# Altium schematic sheet clock_generator.SchDoc: Fine Delay FMC
size 297 x 209 mm; CheckedBy: B. Civel; Author: TW; CompanyName: CERN; DrawnBy: TW, GK; Engineer: TW; Organization: CERN; Address1: European Organization for Nuclear Research; Address2: CH-1211 Geneve 23 - Switzerland; DocumentNumber: 2; Revision: -; SheetNumber: 2; SheetTotal: 10; ModifiedBy: B. Civel; CreateDate: 16/08/2012; CheckedDate: 06/06/2013; Title2: PLL & clock distribution; EDA_Number: EDA-02267-V6-1; Projet: Fine Delay FMC (FMCDel1ns4cha); DivGrp: BE-CO; Designer: TW, GK; ModifiedDate: 16/08/2012
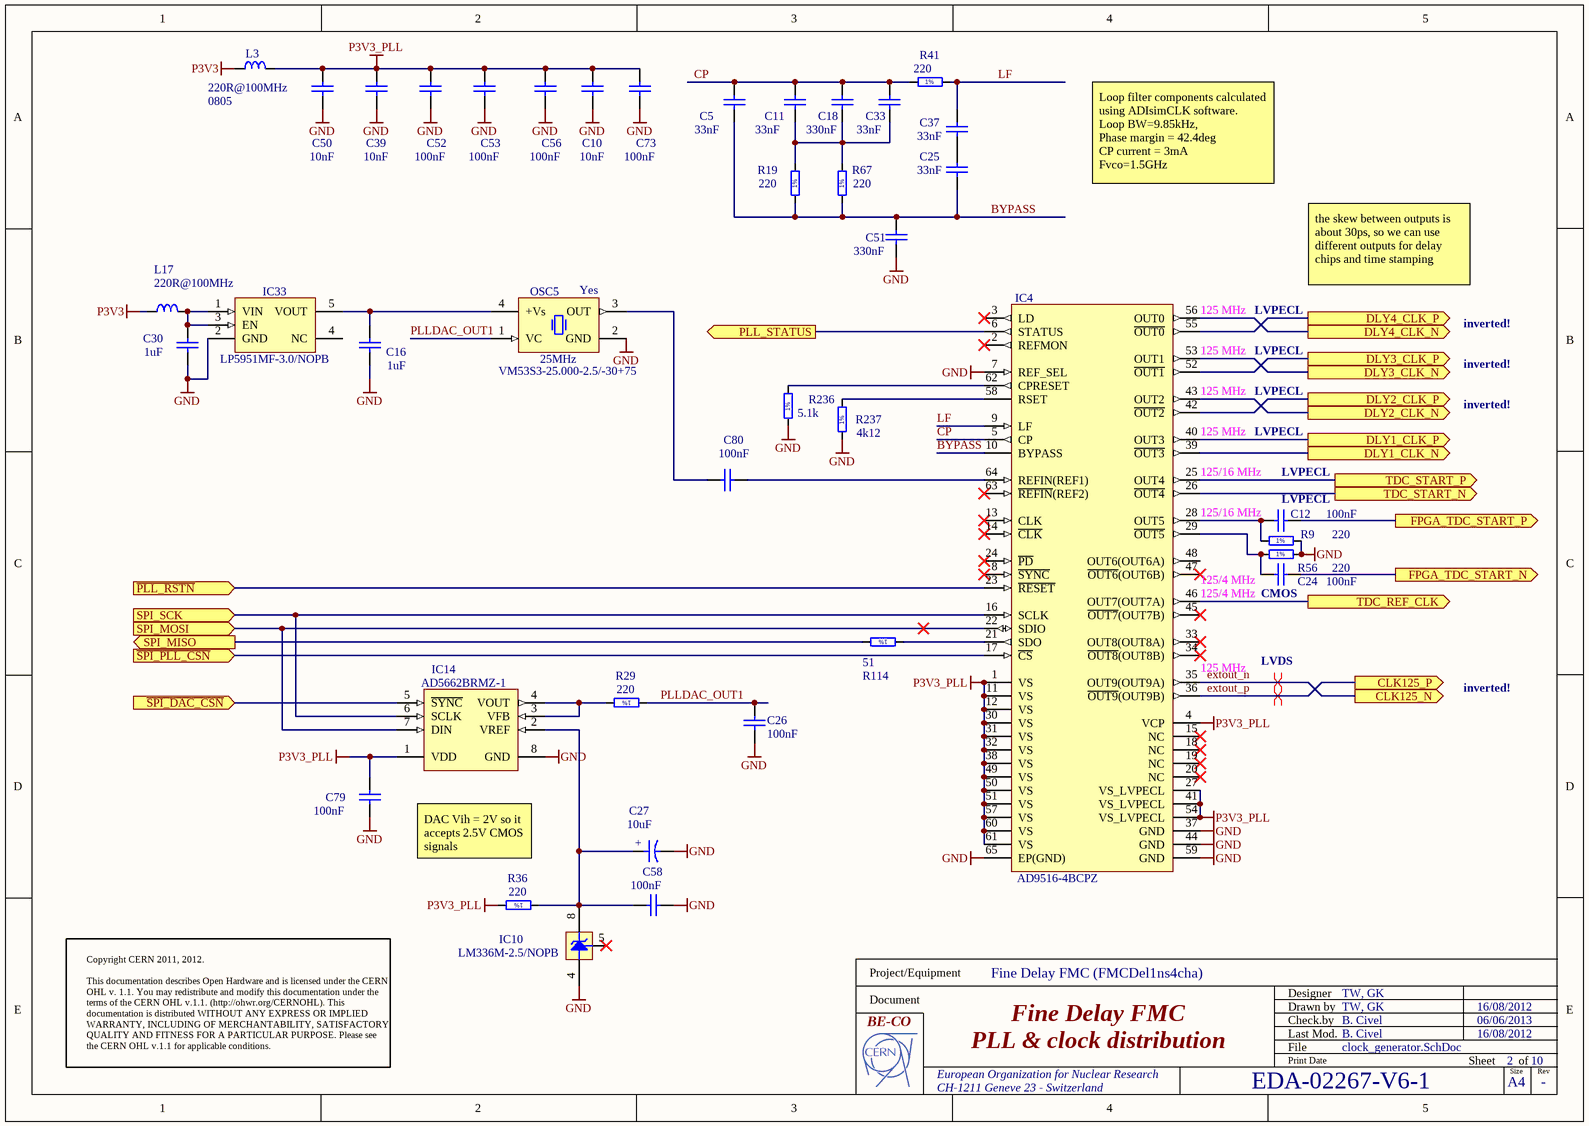
[diagram p0: clock_generator.SchDoc]

## Parts
C5  33nF  [CAPC1608X87N]
C10  10nF  [CAPC1608X87N]
C11  33nF  [CAPC1608X87N]
C12  100nF  [CAPC1608X87N]
C16  1uF  [CAPC2012X140N]
C18  330nF  [CAPC1608X87N]
C24  100nF  [CAPC1608X87N]
C25  33nF  [CAPC1608X87N]
C26  100nF  [CAPC1608X87N]
C27  10uF  [CAPMP3528X210N]
C30  1uF  [CAPC2012X140N]
C33  33nF  [CAPC1608X87N]
C37  33nF  [CAPC1608X87N]
C39  10nF  [CAPC1608X87N]
C50  10nF  [CAPC1608X87N]
C51  330nF  [CAPC1608X87N]
C52  100nF  [CAPC1608X87N]
C53  100nF  [CAPC1608X87N]
C56  100nF  [CAPC1608X87N]
C58  100nF  [CAPC1608X87N]
C73  100nF  [CAPC1608X87N]
C79  100nF  [CAPC1608X87N]
C80  100nF  [CAPC1608X87N]
IC4  AD9516-4BCPZ  [QFN50P900X900X100-65N-S635]
IC10  LM336M-2.5/NOPB  [SOIC127P600X175-8N]
IC14  AD5662BRMZ-1  [SOP65P490X110-8N]
IC33  LP5951MF-3.0/NOPB  [SOT95P284X122-5N]
L3  220R@100MHz  Case: 0805  [INDC2012X105N]
L17  220R@100MHz  [INDC2012X105N]
OSC5  25MHz  Manufacturer Part Number: VM53S3-25.000-2.5/-30+75  Mounted: Yes  [OSCCC320X500X160-4N]
R9  220  [RESC1608X55N]
R19  220  [RESC1608X55N]
R29  220  [RESC1608X55N]
R36  220  [RESC1608X55N]
R41  220  [RESC1608X55N]
R56  220  [RESC1608X55N]
R67  220  [RESC1608X55N]
R114  51  [RESC1608X55N]
R236  5.1k  [RESC1608X55N]
R237  4k12  [RESC1608X55N]

## Ports
CLK125_N (out), CLK125_P (out), DLY1_CLK_N (out), DLY1_CLK_P (out), DLY2_CLK_N (out), DLY2_CLK_P (out), DLY3_CLK_N (out), DLY3_CLK_P (out), DLY4_CLK_N (out), DLY4_CLK_P (out), FPGA_TDC_START_N (out), FPGA_TDC_START_P (out), PLL_STATUS (out), SPI_MISO (out), SPI_MOSI (in), SPI_SCK (in), TDC_REF_CLK (out), TDC_START_N (out), TDC_START_P (out), ~{PLL_RSTN} (in), ~{SPI_DAC_CSN} (in), ~{SPI_PLL_CSN} (in)

## Nets
GND: C10.2 C16.2 C26.2 C27.2 C30.2 C39.2 C50.2 C51.1 C52.1 C53.1 C56.1 C58.1 C73.1 C79.1 IC4.7(REF_SEL) IC4.37(GND) IC4.44(GND) IC4.59(GND) IC4.65(EP(GND)) IC10.4(A) IC14.8(GND) IC33.2(GND) OSC5.2(GND) R9.2 R56.2 R236.1 R237.1
P3V3: L3.1 L17.1
P3V3_PLL: C10.1 C39.1 C50.1 C52.2 C53.2 C56.2 C73.2 C79.2 IC4.1(VS) IC4.4(VCP) IC4.11(VS) IC4.12(VS) IC4.27(VS_LVPECL) IC4.30(VS) IC4.31(VS) IC4.32(VS) IC4.38(VS) IC4.41(VS_LVPECL) IC4.49(VS) IC4.50(VS) IC4.51(VS) IC4.54(VS_LVPECL) IC4.57(VS) IC4.60(VS) IC4.61(VS) IC14.1(VDD) L3.2 R36.2
~{PLL_RSTN}: IC4.23(~{RESET}) ; port ~{PLL_RSTN}
~{SPI_DAC_CSN}: IC14.5(~{SYNC}) ; port ~{SPI_DAC_CSN}
~{SPI_PLL_CSN}: IC4.17(~{CS}) ; port ~{SPI_PLL_CSN}
BYPASS: C5.1 C25.1 C51.2 IC4.10(BYPASS) R19.1 R67.1
CP: C5.2 C11.2 C18.2 C33.2 IC4.5(CP) R41.1
DLY1_CLK_N: IC4.39(~{OUT3}) ; port DLY1_CLK_N
DLY1_CLK_P: IC4.40(OUT3) ; port DLY1_CLK_P
DLY2_CLK_N: IC4.43(OUT2) ; port DLY2_CLK_N
DLY2_CLK_P: IC4.42(~{OUT2}) ; port DLY2_CLK_P
DLY3_CLK_N: IC4.53(OUT1) ; port DLY3_CLK_N
DLY3_CLK_P: IC4.52(~{OUT1}) ; port DLY3_CLK_P
DLY4_CLK_N: IC4.56(OUT0) ; port DLY4_CLK_N
DLY4_CLK_P: IC4.55(~{OUT0}) ; port DLY4_CLK_P
extout_n: IC4.35(OUT9(OUT9A)) ; port CLK125_N
extout_p: IC4.36(~{OUT9}(OUT9B)) ; port CLK125_P
FPGA_TDC_START_N: C24.1 ; port FPGA_TDC_START_N
FPGA_TDC_START_P: C12.1 ; port FPGA_TDC_START_P
LF: C37.2 IC4.9(LF) R41.2
PLL_STATUS: IC4.6(STATUS) ; port PLL_STATUS
PLLDAC_OUT1: C26.1 OSC5.1(VC) R29.1
SPI_MISO: R114.2 ; port SPI_MISO
SPI_MOSI: IC4.22(SDIO) IC14.7(DIN) ; port SPI_MOSI
SPI_SCK: IC4.16(SCLK) IC14.6(SCLK) ; port SPI_SCK
TDC_REF_CLK: IC4.46(OUT7(OUT7A)) ; port TDC_REF_CLK
TDC_START_N: IC4.26(~{OUT4}) ; port TDC_START_N
TDC_START_P: IC4.25(OUT4) ; port TDC_START_P
NetC11_1: C11.1 C18.1 C33.1 R19.2 R67.2
NetC12_2: C12.2 IC4.28(OUT5) R9.1
NetC16_1: C16.1 IC33.5(VOUT) OSC5.4(+Vs)
NetC24_2: C24.2 IC4.29(~{OUT5}) R56.1
NetC25_2: C25.2 C37.1
NetC27_1: C27.1 C58.2 IC10.8(C) IC14.2(VREF) R36.1
NetC30_1: C30.1 IC33.1(VIN) IC33.3(EN) L17.2
NetC80_1: C80.1 IC4.64(REFIN(REF1))
NetC80_2: C80.2 OSC5.3(OUT)
NetIC4_21: IC4.21(SDO) R114.1
NetIC4_58: IC4.58(RSET) R237.2
NetIC4_62: IC4.62(CPRESET) R236.2
NetIC14_3: IC14.3(VFB) IC14.4(VOUT) R29.2

Not connected (* = marked no-connect by the designer): IC4 2(REFMON)* 3(LD)* 8(~{SYNC})* 13(CLK)* 14(~{CLK})* 15(NC)* 18(NC)* 19(NC)* 20(NC)* 24(~{PD})* 33(OUT8(OUT8A))* 34(~{OUT8}(OUT8B))* 45(~{OUT7}(OUT7B))* 47(~{OUT6}(OUT6B))* 48(OUT6(OUT6A)) 63(~{REFIN}(REF2))*; IC10 5(Adj)*; IC33 4(NC)

## Layout directives
differential pair: extout_n, extout_p

## Notes on the sheet
- Loop filter components calculated using ADIsimCLK software.
  Loop BW=9.85kHz,
  Phase margin = 42.4deg
  CP current = 3mA
  Fvco=1.5GHz
- (near IC4) 125 MHz
- LVPECL
- the skew between outputs is about 30ps, so we can use different outputs for delay chips and time stamping
- inverted!
- 125/16 MHz
- (near C12) LVPECL
- 125/4 MHz
- (near C24) CMOS
- LVDS
- DAC Vih = 2V so it accepts 2.5V CMOS signals
- Copyright CERN 2011, 2012.
  This documentation describes Open Hardware and is licensed under the CERN OHL v. 1.1. You may redistribute and modify this documentation under the terms of the CERN OHL v.1.1. (http://ohwr.org/CERNOHL). This documentation is distributed WITHOUT ANY EXPRESS OR IMPLIED WARRANTY, INCLUDING OF MERCHANTABILITY, SATISFACTORY QUALITY AND FITNESS FOR A PARTICULAR PURPOSE. Please see the CERN OHL v.1.1 for applicable conditions.
- Project/Equipment
- Document
- Designer
- Drawn by
- Check.by
- File
- Last Mod.
- Print Date
- Sheet
- Size
- A4
- of
- Rev
- (in symbol CTE3528-21_10UF_16V_20%_SANYO_TQC) +
- (in symbol R0603_4K12_1%_0.1W_100PPM) 1%
- (in symbol R0603_5K1_1%_0.1W_100PPM) 1%
- (in symbol R0603_51R_1%_0.1W_100PPM) 1%
- (in symbol R0603_220R_1%_0.1W_100PPM) 1%

## Library data of the parts
C5 C11 C25 C33 C37 = CC0603_33NF_25V_10%_X7R: Non-polarised capacitor; Part Description: SMD Multilayer Chip Ceramic Capacitor; Manufacturer: GENERIC; Manufacturer1 Part Number: 223891615643; Voltage: 25V; TC: X7R; Tolerance: ±10%; Table: Capacitors SMD; Part Number: CC0603_33NF_25V_10%_X7R; Component Kind: Standard; Component Type: Standard; Pin Count: 2; Value: 33nF; Status: Preferred; Manufacturer Part Number: CC0603_33NF_25V_10%_X7R; Case: 0603; Mounted: Yes; Socket: No; SMD: Yes; Manufacturer1 Example: PHYCOMP; Manufacturer1 ComponentHeight: 0.87mm; HelpURL: \\cern.ch\dfs\Applications\Altium\Datasheets\CC0603_X7R_PHYCOMP.pdf; Author: CERN DEM JLC; CreateDate: 03/12/2007; LatestRevisionDate: 03/12/2007
C10 C39 C50 = CC0603_10NF_50V_10%_X7R: Non-polarised capacitor; Part Description: SMD Multilayer Chip Ceramic Capacitor; Manufacturer: GENERIC; Manufacturer1 Part Number: 223858615636; Voltage: 50V; TC: X7R; Tolerance: ±10%; Table: Capacitors SMD; Part Number: CC0603_10NF_50V_10%_X7R; Component Kind: Standard; Component Type: Standard; Pin Count: 2; Value: 10nF; Status: Preferred; Manufacturer Part Number: CC0603_10NF_50V_10%_X7R; Case: 0603; Mounted: Yes; Socket: No; SMD: Yes; Manufacturer1 Example: PHYCOMP; Manufacturer1 ComponentHeight: 0.87mm; HelpURL: \\cern.ch\dfs\Applications\Altium\Datasheets\CC0603_X7R_PHYCOMP.pdf; Author: CERN DEM JLC; CreateDate: 03/12/2007; LatestRevisionDate: 03/12/2007
C12 C24 C26 C52 C53 C56 C58 C73 = CC0603_100NF_50V_10%_X7R: Non-polarised capacitor; Part Description: SMD Multilayer Chip Ceramic Capacitor; Manufacturer: GENERIC; Manufacturer1 Part Number: 223858615649; Voltage: 50V; TC: X7R; Tolerance: ±10%; Table: Capacitors SMD; Part Number: CC0603_100NF_50V_10%_X7R; Component Kind: Standard; Component Type: Standard; Pin Count: 2; Value: 100nF; Status: Preferred; Manufacturer Part Number: CC0603_100NF_50V_10%_X7R; Case: 0603; Mounted: Yes; Socket: No; SMD: Yes; Manufacturer1 Example: PHYCOMP; Manufacturer1 ComponentHeight: 0.87mm; HelpURL: \\cern.ch\dfs\Applications\Altium\Datasheets\CC0603_X7R_PHYCOMP.pdf; Author: CERN DEM JLC; CreateDate: 03/12/2007; LatestRevisionDate: 03/12/2007
C16 C30 = CC0805_1UF_35V_20%_X7R: Non-polarised capacitor; Part Description: SMD Multilayer Chip Ceramic Capacitor; Manufacturer: GENERIC; Manufacturer1 Part Number: GMK212B7105MG-T; Voltage: 35V; TC: X7R; Tolerance: ±20%; Table: Capacitors SMD; Part Number: CC0805_1UF_35V_20%_X7R; Component Kind: Standard; Component Type: Standard; Pin Count: 2; Value: 1uF; Status: Not Recommended; Manufacturer Part Number: CC0805_1UF_35V_20%_X7R; Case: 0805; Mounted: Yes; Socket: No; SMD: Yes; Manufacturer1 Example: TAIYO YUDEN; Manufacturer1 ComponentHeight: 1.35mm; HelpURL: \\cern.ch\dfs\Applications\Altium\Datasheets\CC0805_X7R_TAIYO-YUDEN_HIGH-VALUE.pdf; Author: CERN DEM JLC; CreateDate: 22/06/2011; LatestRevisionDate: 22/06/2011
C18 C51 = CC0603_330NF_16V_10%_X5R: Non-polarised capacitor; Part Description: SMD Multilayer Chip Ceramic Capacitor; Manufacturer: GENERIC; Manufacturer1 Part Number: 223878613656; Voltage: 16V; TC: X5R; Tolerance: ±10%; Table: Capacitors SMD; Part Number: CC0603_330NF_16V_10%_X5R; Component Kind: Standard; Component Type: Standard; Pin Count: 2; Value: 330nF; Status: Preferred; Manufacturer Part Number: CC0603_330NF_16V_10%_X5R; Case: 0603; Mounted: Yes; Socket: No; SMD: Yes; Manufacturer1 Example: PHYCOMP; Manufacturer1 ComponentHeight: 0.87mm; HelpURL: \\cern.ch\dfs\Applications\Altium\Datasheets\CC0805_X5R_PHYCOMP_HC.pdf; Author: CERN DEM JLC; CreateDate: 03/12/2007; LatestRevisionDate: 03/12/2007
C27 = CTE3528-21_10UF_16V_20%_SANYO_TQC: Polarised capacitor; Part Description: ESR 0R1 Solid Tantalum Chip Capacitor; Manufacturer: SANYO; Manufacturer Part Number: 16TQC10M; Voltage: 16V; Tolerance: ±20%; Table: Capacitors SMD; Part Number: CTE3528-21_10UF_16V_20%_SANYO_TQC; Component Kind: Standard; Component Type: Standard; Pin Count: 2; Value: 10uF; Status: Obsolete; Case: B; Mounted: Yes; Socket: No; SMD: Yes; ComponentHeight: 2.1mm; HelpURL: \\cern.ch\dfs\Applications\Altium\Datasheets\CTE_SANYO_TQC.pdf; Author: CERN DEM JLC; CreateDate: 29/06/2011; LatestRevisionDate: 01/09/2014
C79 C80 = CC0603_100NF_50V_10%_X7R: Non-polarised capacitor; Manufacturer1 Part Number: 223858615649; Manufacturer: GENERIC; Part Description: SMD Multilayer Chip Ceramic Capacitor; Table: Capacitors SMD; TC: X7R; Tolerance: ±10%; Voltage: 50V; Author: CERN DEM JLC; Case: 0603; Component Type: Standard; CreateDate: 03/12/2007; HelpURL: \\cern.ch\dfs\Applications\Altium\Datasheets\CC0603_X7R_PHYCOMP.pdf; LatestRevisionDate: 03/12/2007; Manufacturer1 ComponentHeight: 0.87mm; Manufacturer1 Example: PHYCOMP; Manufacturer Part Number: CC0603_100NF_50V_10%_X7R; Mounted: Yes; Pin Count: 2; SMD: Yes; Socket: No; Status: Preferred; Value: 100nF; Part Number: CC0603_100NF_50V_10%_X7R; Component Kind: Standard
IC4 = AD9516-4BCPZ: 14-Output Clock Generator with Integrated 1.6 GHz VCO; Manufacturer: ANALOG DEVICES; Table: Logic; PressFit: No; Bonding: No; Part Number: AD9516-4BCPZ; Component Kind: Standard; Component Type: Standard; Device: AD9516-4BCPZ; PackageDescription: QFN,0.50mm pitch,square;64 pin,9.00mm L X 9.00mm W X 1.00mm H body (6.35mm X 6.35mm thermal tab), IPC Medium Density; Part Description: 14-Output Clock Generator with Integrated 1.6 GHz VCO; Manufacturer Part Number: AD9516-4BCPZ; Pin Count: 65; Case: QFN64; Mounted: Yes; Socket: No; SMD: Yes; ComponentHeight: 1.0mm; HelpURL: \\cern.ch\dfs\Applications\Altium\Datasheets\AD9516-4BCPZ.pdf; Author: CERN DEM JLC; CreateDate: 18/01/2010; LatestRevisionDate: 18/01/2010
IC10 = LM336M-2.5/NOPB: Reference Diode; Part Description: 2.5V Voltage Reference Diode; Manufacturer: TEXAS INSTRUMENTS; Table: Regulators; PressFit: No; Bonding: No; Part Number: LM336M-2.5/NOPB; Component Kind: Standard; Component Type: Standard; Device: LM336M-2.5/NOPB; PackageDescription: SOIC 8, Pitch 1.27mm - Body 4x5mm, IPC Medium Density; Manufacturer Part Number: LM336M-2.5/NOPB; Pin Count: 3; Case: SOIC8; Mounted: Yes; Socket: No; SMD: Yes; ComponentHeight: 1.75mm; HelpURL: \\cern.ch\dfs\Applications\Altium\Datasheets\LM336M-2.5-NOPB.pdf; Author: CERN DEM JLC; CreateDate: 12/04/2010; LatestRevisionDate: 16/09/2014
IC14 = AD5662BRMZ-1: 2.7V to 5.5V, 250uA, Rail-to-Rail Output 16-Bit nanoDAC; Manufacturer: ANALOG DEVICES; Table: Analog & Interface; PressFit: No; Bonding: No; Part Number: AD5662BRMZ-1; Component Kind: Standard; Component Type: Standard; Device: AD5662BRMZ-1; PackageDescription: SOP, 8-Leads, Body 3.0x3.0mm, Pitch 0.65mm, IPC Medium Density; Part Description: 2.7V to 5.5V, 250uA, Rail-to-Rail Output 16-Bit nanoDAC; Manufacturer Part Number: AD5662BRMZ-1; Pin Count: 8; Case: MSOP8; Mounted: Yes; Socket: No; SMD: Yes; ComponentHeight: 1.1mm; Author: CERN DEM JLC; HelpURL: \\cern.ch\dfs\Applications\Altium\Datasheets\AD5662BRMZ-1.pdf; CreateDate: 10/01/2011; LatestRevisionDate: 10/01/2011
IC33 = LP5951MF-3.0/NOPB: 150mA Micropower Low-Dropout CMOS Voltage Regulator; Part Description: 3V,  150mA Micropower Low-Dropout CMOS Voltage Regulator; Manufacturer: TEXAS INSTRUMENTS; Table: Regulators; PressFit: No; Bonding: No; Part Number: LP5951MF-3.0/NOPB; Component Kind: Standard; Component Type: Standard; Device: LP5951MF-3.0/NOPB; PackageDescription: SOT23 5, Pitch 0.95mm - Body 1.67x2.99mm, IPC Medium Density; Manufacturer Part Number: LP5951MF-3.0/NOPB; Pin Count: 5; Case: SOT23-5; Mounted: Yes; Socket: No; SMD: Yes; ComponentHeight: 1.19mm; HelpURL: \\cern.ch\dfs\Applications\Altium\Datasheets\LP5951MF-3.0-NOPB.pdf; Author: CERN DEM JLC; CreateDate: 24/01/2011; LatestRevisionDate: 16/09/2014
L3 L17 = IND0805_MURATA_BLM21PG221SN1D: Inductor; Part Description: SMD EMIFIL Suppression Chip Ferrite Bead; Manufacturer: MURATA; Power: 2A; Resistance: 0.05R; Tolerance: ±25%; Table: Inductors SMD; Part Number: IND0805_MURATA_BLM21PG221SN1D; Component Kind: Standard; Component Type: Standard; Pin Count: 2; Value: 220R@100MHz; Status: None; Manufacturer Part Number: BLM21PG221SN1D; Mounted: Yes; Socket: No; SMD: Yes; ComponentHeight: 1.05mm; HelpURL: \\cern.ch\dfs\Applications\Altium\Datasheets\IND0402_MURATA_BLM21P.pdf; Author: CERN DEM JLC; CreateDate: 25/01/2010; LatestRevisionDate: 25/01/2010
  L17: Case: 0805
OSC5 = OSC_25MHZ_MERCURY_VM53S3-25.000-2.5/-30+75: Oscillator 4 pins 1=VC 2=GND 3=OUT 4=+Vs; Part Description: 3V ±2.5ppmVoltage Controlled Temperature Compensated Crystal Oscillator VM53S3 Series; Manufacturer: MERCURY ELECTRONICS; Table: Crystals & Oscillators; PressFit: No; Bonding: No; Part Number: OSC_25MHZ_MERCURY_VM53S3-25.000-2.5/-30+75; Component Kind: Standard; Component Type: Standard; PackageDescription: SMD Oscillator, Corner Convave, 4 pins, 5x3.2mm; Value: 25MHz; Pin Count: 4; Socket: No; SMD: Yes; ComponentHeight: 1.6mm; HelpURL: \\cern.ch\dfs\Applications\Altium\Datasheets\OSC_MERCURY_VM53S3.pdf; Author: CERN DEM JLC; CreateDate: 20/01/2010; LatestRevisionDate: 24/01/2011
R9 R19 R29 R36 R41 R56 R67 = R0603_220R_1%_0.1W_100PPM: Resistor - 1%; Part Description: General Purpose Thick Film Chip Resistor; Manufacturer: GENERIC; Manufacturer1 Part Number: NRC06F2200TRF; Power: 0.1W; TC: ±100ppm/°C; Table: Resistors SMD; Part Number: R0603_220R_1%_0.1W_100PPM; Component Kind: Standard; Component Type: Standard; Pin Count: 2; Value: 220; Status: Preferred; Tolerance: ±1%; Manufacturer Part Number: R0603_220R_1%_0.1W_100PPM; Case: 0603; Mounted: Yes; Socket: No; SMD: Yes; Manufacturer1 Example: NIC COMPONENT; Manufacturer1 ComponentHeight: 0.55mm; HelpURL: \\cern.ch\dfs\Applications\Altium\Datasheets\R0603_NIC_NRC.pdf; Author: CERN DEM JLC; CreateDate: 12/3/2007; LatestRevisionDate: 3/13/2008
R114 = R0603_51R_1%_0.1W_100PPM: Resistor - 1%; Part Description: General Purpose Thick Film Chip Resistor; Manufacturer: GENERIC; Manufacturer1 Part Number: NRC06F51R0TRF; Power: 0.1W; TC: ±100ppm/°C; Table: Resistors SMD; Part Number: R0603_51R_1%_0.1W_100PPM; Component Kind: Standard; Component Type: Standard; Pin Count: 2; Value: 51; Status: Preferred; Tolerance: ±1%; Manufacturer Part Number: R0603_51R_1%_0.1W_100PPM; Case: 0603; Mounted: Yes; Socket: No; SMD: Yes; Manufacturer1 Example: NIC COMPONENT; Manufacturer1 ComponentHeight: 0.55mm; HelpURL: \\cern.ch\dfs\Applications\Altium\Datasheets\R0603_NIC_NRC.pdf; Author: CERN DEM JLC; CreateDate: 12/3/2007; LatestRevisionDate: 3/13/2008
R236 = R0603_5K1_1%_0.1W_100PPM: Resistor - 1%; Part Description: General Purpose Thick Film Chip Resistor; Manufacturer: GENERIC; Manufacturer1 Part Number: NRC06F5101TRF; Value: 5k1; Power: 0.1W; TC: ±100ppm/°C; Table: Resistors SMD; Part Number: R0603_5K1_1%_0.1W_100PPM; Component Kind: Standard; Component Type: Standard; Designator: Resistor - 1%; Library Reference: Resistor - 1%; Pin Count: 2; Status: Preferred; Tolerance: ±1%; Manufacturer Part Number: R0603_5K1_1%_0.1W_100PPM; Case: 0603; Mounted: Yes; Socket: No; SMD: Yes; Manufacturer1 Example: NIC COMPONENT; Manufacturer1 ComponentHeight: 0.55mm; HelpURL: \\cern.ch\dfs\Applications\Altium\Datasheets\R0603_NIC_NRC.pdf; Author: CERN DEM JLC; CreateDate: 12/3/2007; LatestRevisionDate: 3/13/2008
R237 = R0603_4K12_1%_0.1W_100PPM: Resistor - 1%; Part Description: General Purpose Thick Film Chip Resistor; Manufacturer: GENERIC; Manufacturer1 Part Number: RCW06034K12FKEA; Power: 0.1W; TC: ±100ppm/°C; Table: Resistors SMD; Part Number: R0603_4K12_1%_0.1W_100PPM; Component Kind: Standard; Component Type: Standard; Pin Count: 2; Value: 4k12; Status: Preferred; Tolerance: ±1%; Manufacturer Part Number: R0603_4K12_1%_0.1W_100PPM; Case: 0603; Mounted: Yes; Socket: No; SMD: Yes; Manufacturer1 Example: VISHAY; Manufacturer1 ComponentHeight: 0.55mm; HelpURL: \\cern.ch\dfs\Applications\Altium\Datasheets\R0603_VISHAY_CRCW e3.pdf; Author: CERN DEM JLC; CreateDate: 15/07/2010; LatestRevisionDate: 11/12/2013